# EAGLE design LDAQ-MINI (EAGLE 6.6.0)
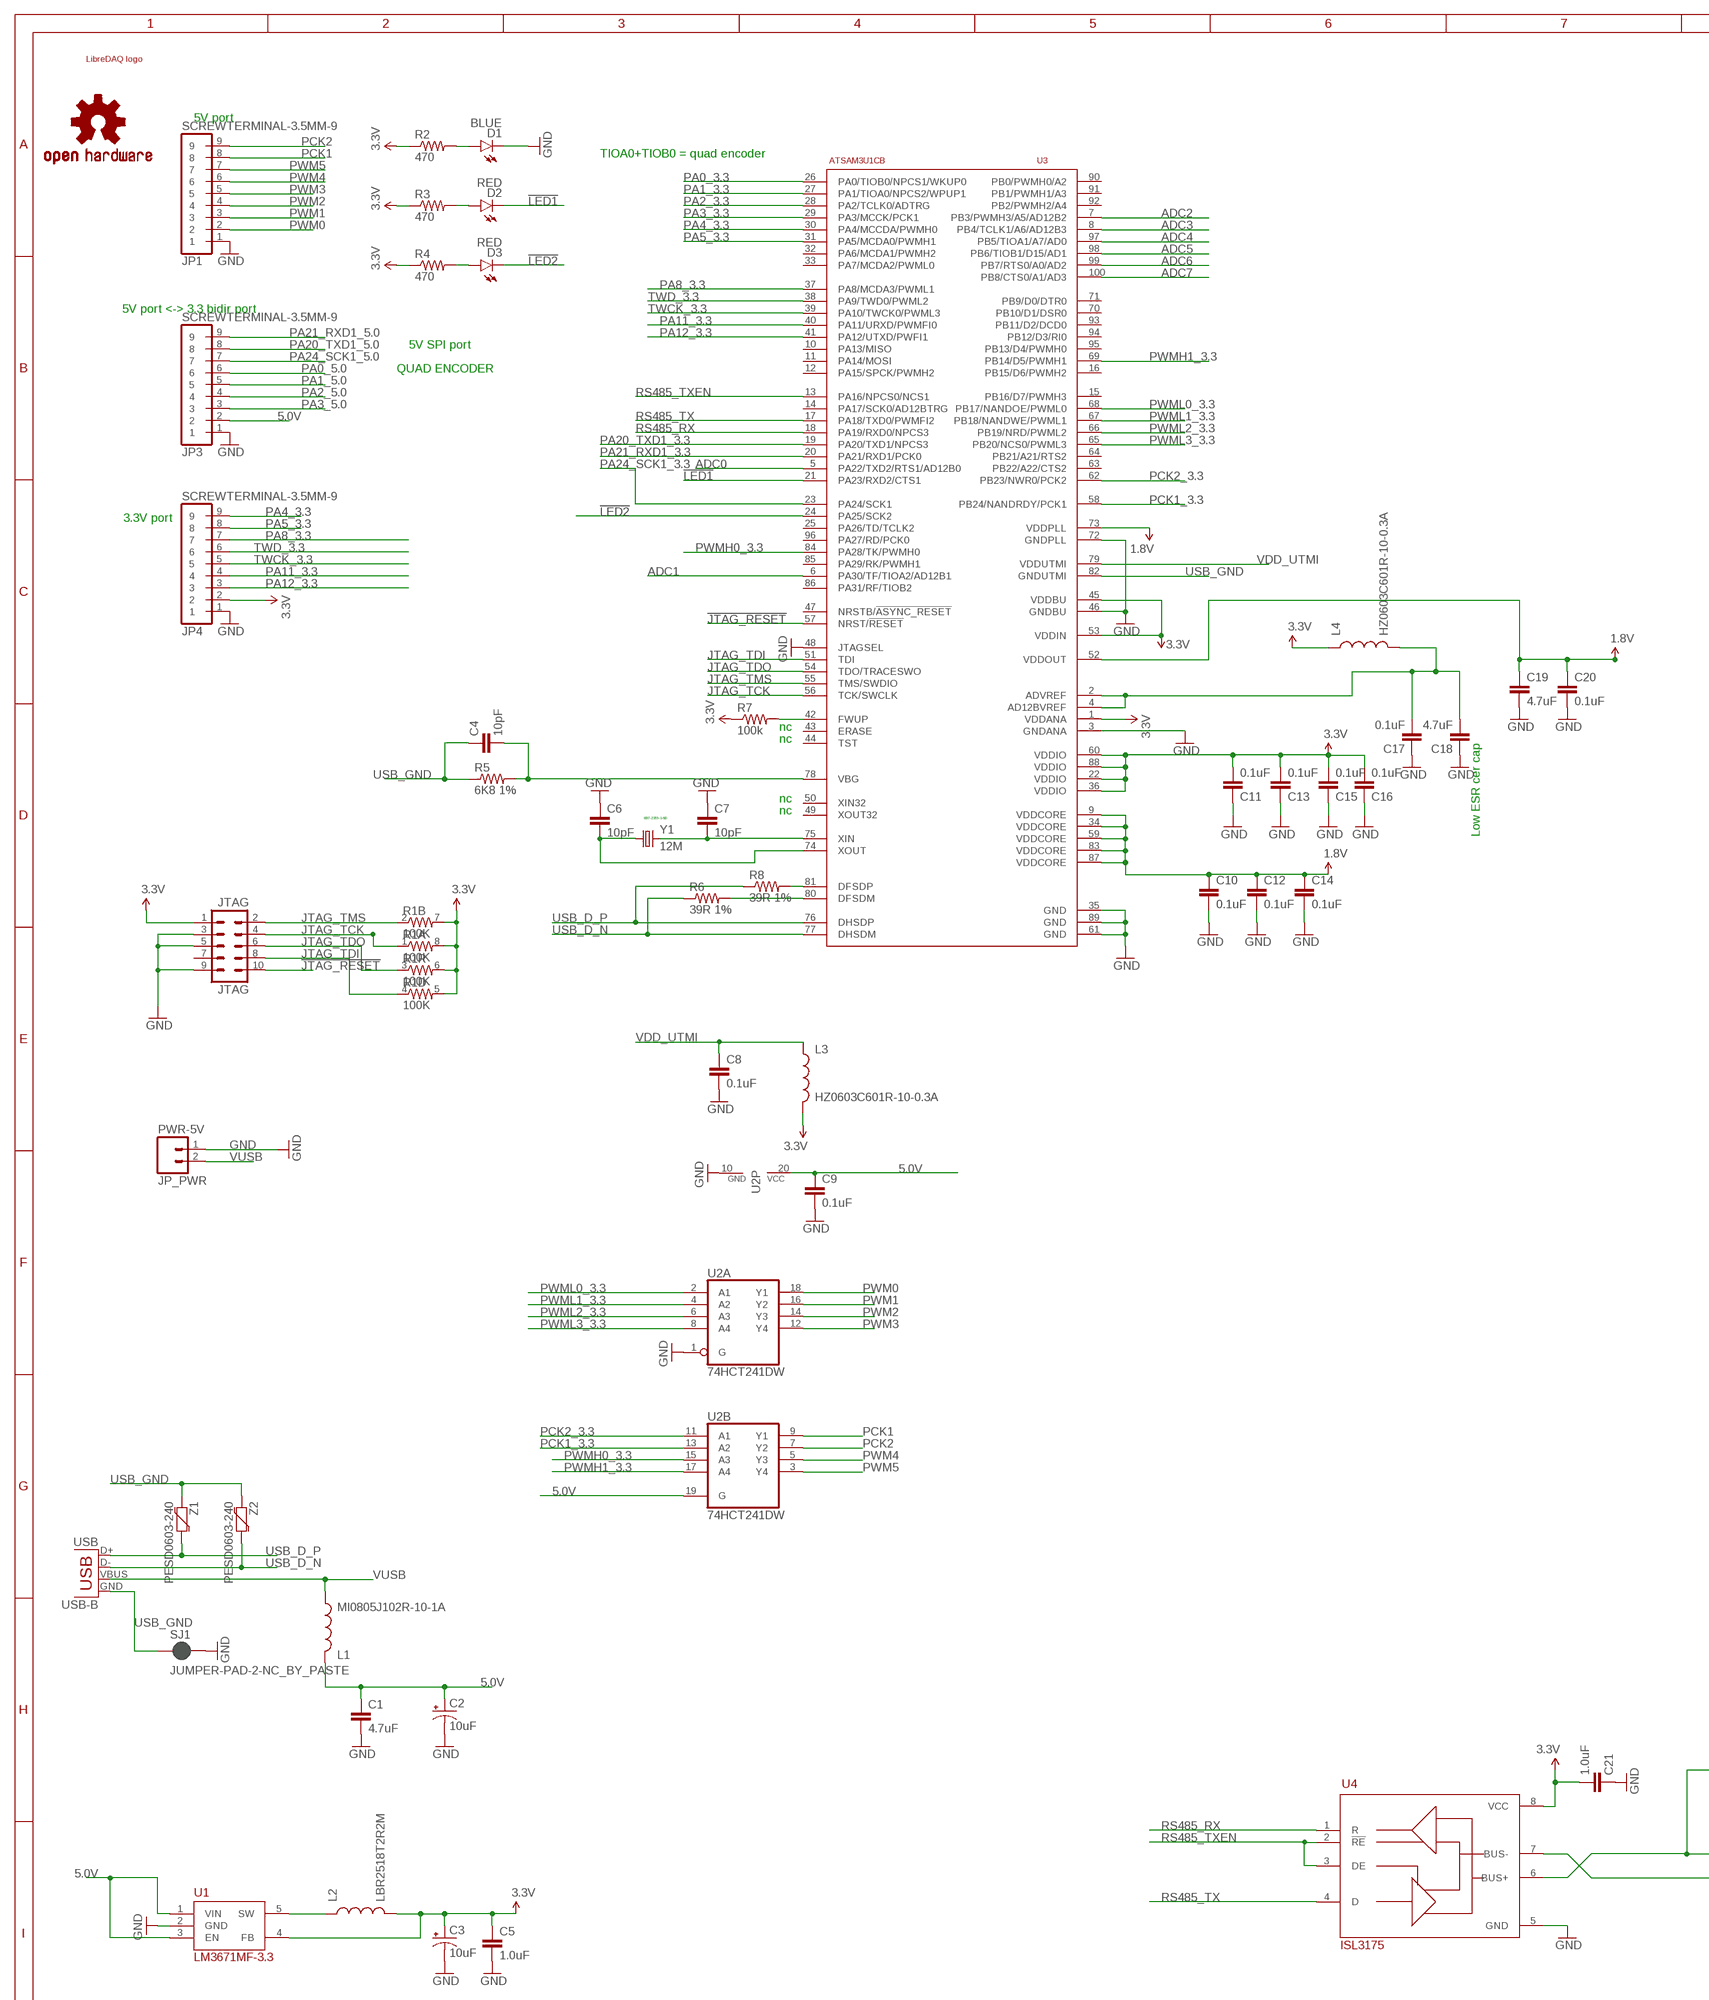
[diagram p0: schematic, sheet 1, part 1 of 2]
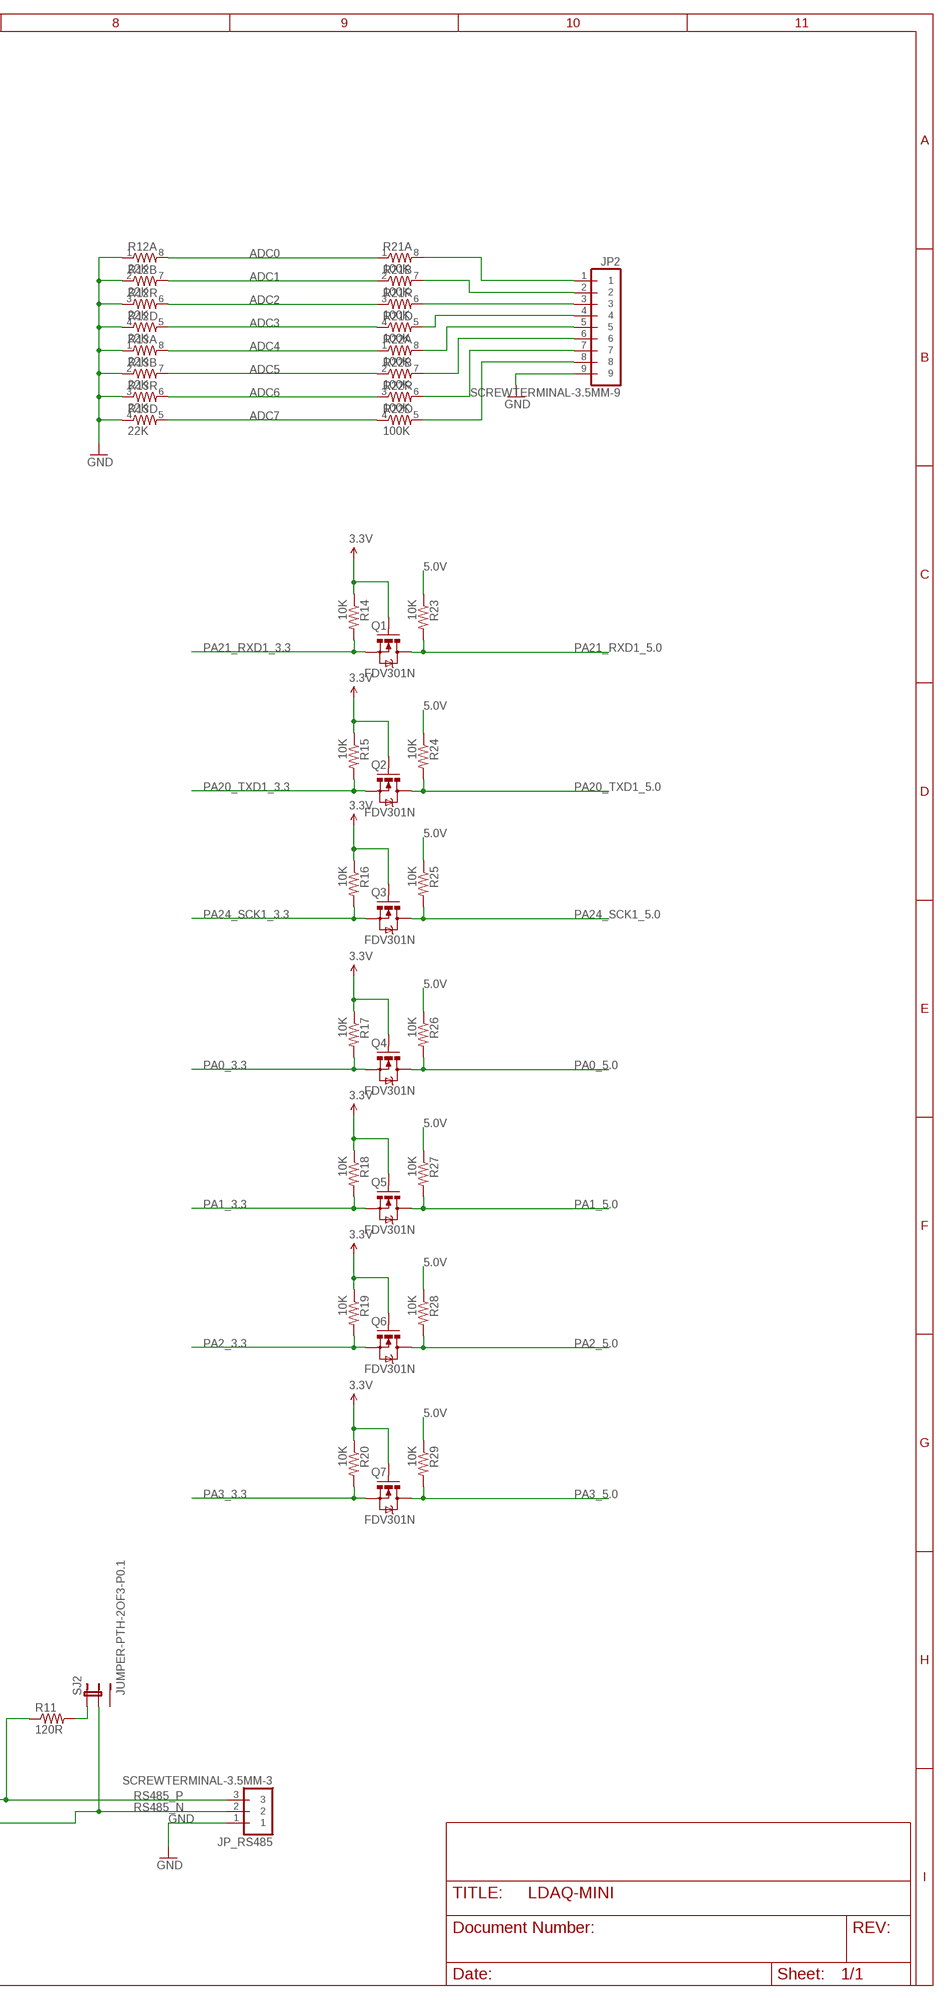
[diagram p1: schematic, sheet 1, part 2 of 2]

## Parts
C1  4.7uF  CAP0603-CAP  [0603-CAP]
C2  10uF  CAP_POL1206  [EIA3216]
C3  10uF  10UF-16V-10%(TANT)  [EIA3216]
C4  10pF  10PF-50V-5%(0603)  [0603-CAP]
C5  1.0uF  1.0UF-25V-+80/-20(0805)  [0805]
C6  10pF  22PF-50V-5%(0603)  [0603-CAP]
C7  10pF  22PF-50V-5%(0603)  [0603-CAP]
C8  0.1uF  0.1UF-25V(+80/-20%)(0603)  [0603-CAP]
C9  0.1uF  0.1UF-25V(+80/-20%)(0603)  [0603-CAP]
C10  0.1uF  0.1UF-25V(+80/-20%)(0603)  [0603-CAP]
C11  0.1uF  0.1UF-25V(+80/-20%)(0603)  [0603-CAP]
C12  0.1uF  0.1UF-25V(+80/-20%)(0603)  [0603-CAP]
C13  0.1uF  0.1UF-25V(+80/-20%)(0603)  [0603-CAP]
C14  0.1uF  0.1UF-25V(+80/-20%)(0603)  [0603-CAP]
C15  0.1uF  0.1UF-25V(+80/-20%)(0603)  [0603-CAP]
C16  0.1uF  0.1UF-25V(+80/-20%)(0603)  [0603-CAP]
C17  0.1uF  0.1UF-25V(+80/-20%)(0603)  [0603-CAP]
C18  4.7uF  10UF-6.3V-20%(0603)  [0603-CAP]
C19  4.7uF  4.7UF-6.3V-10%(0603)0603  [0603-CAP]
C20  0.1uF  0.1UF-25V(+80/-20%)(0603)  [0603-CAP]
C21  1.0uF  1.0UF-16V-10%(0603)  [0603-CAP]
D1  BLUE  LED-BLUE1206  [LED-1206]
D2  RED  LED-RED1206  [LED-1206]
D3  RED  LED-RED1206  [LED-1206]
JP1  SCREWTERMINAL-3.5MM-9  [SCREWTERMINAL-3.5MM-9]
JP2  SCREWTERMINAL-3.5MM-9  [SCREWTERMINAL-3.5MM-9]
JP3  SCREWTERMINAL-3.5MM-9  [SCREWTERMINAL-3.5MM-9]
JP4  SCREWTERMINAL-3.5MM-9  [SCREWTERMINAL-3.5MM-9]
JP_PWR  PWR-5V  M02JST-PTH-VERT  [JST-2-PTH-VERT]
JP_RS485  SCREWTERMINAL-3.5MM-3  [SCREWTERMINAL-3.5MM-3]
JTAG  JTAG  M05X2PTH  [AVR_ICSP]
L1  MI0805J102R-10-1A  INDUCTOR0805  [0805]
L2  LBR2518T2R2M  INDUCTOR1007  [1007]
L3  HZ0603C601R-10-0.3A  INDUCTOR0603  [0603]
L4  HZ0603C601R-10-0.3A  INDUCTOR0603  [0603]
LOGO1  LIBREDAQ_LOGO_MINILOGO_GENERIC  [LIBREDAQ_LOGO]
LOGO2  OSHW-LOGOL  [OSHW-LOGO-L]
Q1  FDV301N  MOSFET-NCHANNELSMD  [SOT23-3]
Q2  FDV301N  MOSFET-NCHANNELSMD  [SOT23-3]
Q3  FDV301N  MOSFET-NCHANNELSMD  [SOT23-3]
Q4  FDV301N  MOSFET-NCHANNELSMD  [SOT23-3]
Q5  FDV301N  MOSFET-NCHANNELSMD  [SOT23-3]
Q6  FDV301N  MOSFET-NCHANNELSMD  [SOT23-3]
Q7  FDV301N  MOSFET-NCHANNELSMD  [SOT23-3]
R1  100K  RESISTOR-ARRAY0603-ARV  [0603-ARV]
R2  470  470OHM1/10W1%(0603)  [0603-RES]
R3  470  470OHM1/10W1%(0603)  [0603-RES]
R4  470  470OHM1/10W1%(0603)  [0603-RES]
R5  6K8 1%  RESISTOR0603  [0603-RES]
R6  39R 1%  RESISTOR0603  [0603-RES]
R7  100k  100KOHM-1/10W-1%(0603)  [0603-RES]
R8  39R 1%  RESISTOR1206  [1206]
R11  120R  RESISTOR0603  [0603-RES]
R12  22K  RESISTOR-ARRAY0603-ARV  [0603-ARV]
R13  22K  RESISTOR-ARRAY0603-ARV  [0603-ARV]
R14  10K  RESISTOR0603-RES  [0603-RES]
R15  10K  RESISTOR0603-RES  [0603-RES]
R16  10K  RESISTOR0603-RES  [0603-RES]
R17  10K  RESISTOR0603-RES  [0603-RES]
R18  10K  RESISTOR0603-RES  [0603-RES]
R19  10K  RESISTOR0603-RES  [0603-RES]
R20  10K  RESISTOR0603-RES  [0603-RES]
R21  100K  RESISTOR-ARRAY0603-ARV  [0603-ARV]
R22  100K  RESISTOR-ARRAY0603-ARV  [0603-ARV]
R23  10K  RESISTOR0603-RES  [0603-RES]
R24  10K  RESISTOR0603-RES  [0603-RES]
R25  10K  RESISTOR0603-RES  [0603-RES]
R26  10K  RESISTOR0603-RES  [0603-RES]
R27  10K  RESISTOR0603-RES  [0603-RES]
R28  10K  RESISTOR0603-RES  [0603-RES]
R29  10K  RESISTOR0603-RES  [0603-RES]
SJ1  JUMPER-PAD-2-NC_BY_PASTE  [PAD-JUMPER-2-NC_BY_PASTE_YES_SILK]
SJ2  JUMPER-PTH-2OF3-P0.1  [1X03_LONGPADS]
U1  LM3671MF-3.3  [TOP23-5]
U2  74HCT241DW  [SO20W]
U3  ATSAM3U1CB  [TQFP100]
U4  ISL3175  [SOIC8]
USB  USB-B  USBPTH  [USB-B-PTH]
Y1  12M  CRYSTAL5X3  [CRYSTAL-SMD-5X3]
Z1  PESD0603-240  VARISTOR-0603  [0603-RES]
Z2  PESD0603-240  VARISTOR-0603  [0603-RES]

## Nets
1.8V: C10.1 C12.1 C14.1 C19.1 C20.1 U3.9(VDDCORE) U3.34(VDDCORE) U3.52(VDDOUT) U3.59(VDDCORE) U3.73(VDDPLL) U3.83(VDDCORE) U3.87(VDDCORE)
3.3V: C3.A(+) C5.1 C11.2 C13.2 C15.2 C16.2 C21.2 JP4.2 JTAG.1 L2.2 L3.2 L4.1 Q1.1(G) Q2.1(G) Q3.1(G) Q4.1(G) Q5.1(G) Q6.1(G) Q7.1(G) R1.5 R1.6 R1.7 R1.8 R2.1 R3.1 R4.1 R7.1 R14.1 R15.1 R16.1 R17.1 R18.1 R19.1 R20.1 U1.4(FB) U3.1(VDDANA) U3.22(VDDIO) U3.36(VDDIO) U3.45(VDDBU) U3.53(VDDIN) U3.60(VDDIO) U3.88(VDDIO) U4.8(VCC)
5.0V: C1.1 C2.A(+) C9.1 JP3.2 L1.1 R23.1 R24.1 R25.1 R26.1 R27.1 R28.1 R29.1 U1.1(VIN) U1.3(EN) U2.19(B:G) U2.20(P:VCC)
!JTAG_RESET: JTAG.10 U3.57(NRST/!RESET)
!LED1: D2.C U3.21(PA23/RXD2/CTS1)
!LED2: D3.C U3.24(PA25/SCK2)
ADC0: R12.8 R21.1 U3.5(PA22/TXD2/RTS1/AD12B0)
ADC1: R12.7 R21.2 U3.6(PA30/TF/TIOA2/AD12B1)
ADC2: R12.6 R21.3 U3.7(PB3/PWMH3/A5/AD12B2)
ADC3: R12.5 R21.4 U3.8(PB4/TCLK1/A6/AD12B3)
ADC4: R13.8 R22.1 U3.97(PB5/TIOA1/A7/AD0)
ADC5: R13.7 R22.2 U3.98(PB6/TIOB1/D15/AD1)
ADC6: R13.6 R22.3 U3.99(PB7/RTS0/A0/AD2)
ADC7: R13.5 R22.4 U3.100(PB8/CTS0/A1/AD3)
GND: C1.2 C2.C(-) C3.C(-) C5.2 C6.1 C7.1 C8.2 C9.2 C10.2 C11.1 C12.2 C13.1 C14.2 C15.1 C16.1 C17.1 C18.1 C19.2 C20.2 C21.1 D1.C JP1.1 JP2.9 JP3.1 JP4.1 JP_PWR.1 JP_RS485.1 JTAG.3 JTAG.5 JTAG.9 R12.1 R12.2 R12.3 R12.4 R13.1 R13.2 R13.3 R13.4 SJ1.2 U1.2(GND) U2.1(A:G) U2.10(P:GND) U3.3(GNDANA) U3.35(GND) U3.46(GNDBU) U3.48(JTAGSEL) U3.61(GND) U3.72(GNDPLL) U3.89(GND) U4.5(GND)
JTAG_TCK: JTAG.4 R1.1 U3.56(TCK/SWCLK)
JTAG_TDI: JTAG.8 R1.4 U3.51(TDI)
JTAG_TDO: JTAG.6 R1.3 U3.54(TDO/TRACESWO)
JTAG_TMS: JTAG.2 R1.2 U3.55(TMS/SWDIO)
N$1: C7.2 U3.75(XIN) Y1.3
N$2: C6.2 U3.74(XOUT) Y1.1
N$3: R8.2 U3.81(DFSDP)
N$4: R6.2 U3.80(DFSDM)
N$5: C4.2 R5.2 U3.78(VBG)
N$6: R7.2 U3.42(FWUP)
N$12: L2.1 U1.5(SW)
N$15: R11.2 SJ2.1
N$16: JP2.1 R21.8
N$17: JP2.2 R21.7
N$18: JP2.3 R21.6
N$19: JP2.4 R21.5
N$20: JP2.5 R22.8
N$25: JP2.6 R22.7
N$26: JP2.7 R22.6
N$27: JP2.8 R22.5
N$30: C17.2 C18.2 L4.2 U3.2(ADVREF) U3.4(AD12BVREF)
N$31: D2.A R3.2
N$32: D3.A R4.2
N$33: D1.A R2.2
PA0_3.3: Q4.2(S) R17.2 U3.26(PA0/TIOB0/NPCS1/WKUP0)
PA0_5.0: JP3.6 Q4.3(D) R26.2
PA1_3.3: Q5.2(S) R18.2 U3.27(PA1/TIOA0/NPCS2/WPUP1)
PA1_5.0: JP3.5 Q5.3(D) R27.2
PA2_3.3: Q6.2(S) R19.2 U3.28(PA2/TCLK0/ADTRG)
PA2_5.0: JP3.4 Q6.3(D) R28.2
PA3_3.3: Q7.2(S) R20.2 U3.29(PA3/MCCK/PCK1)
PA3_5.0: JP3.3 Q7.3(D) R29.2
PA4_3.3: JP4.9 U3.30(PA4/MCCDA/PWMH0)
PA5_3.3: JP4.8 U3.31(PA5/MCDA0/PWMH1)
PA8_3.3: JP4.7 U3.37(PA8/MCDA3/PWML1)
PA11_3.3: JP4.4 U3.40(PA11/URXD/PWMFI0)
PA12_3.3: JP4.3 U3.41(PA12/UTXD/PWFI1)
PA20_TXD1_3.3: Q2.2(S) R15.2 U3.19(PA20/TXD1/NPCS3)
PA20_TXD1_5.0: JP3.8 Q2.3(D) R24.2
PA21_RXD1_3.3: Q1.2(S) R14.2 U3.20(PA21/RXD1/PCK0)
PA21_RXD1_5.0: JP3.9 Q1.3(D) R23.2
PA24_SCK1_3.3: Q3.2(S) R16.2 U3.23(PA24/SCK1)
PA24_SCK1_5.0: JP3.7 Q3.3(D) R25.2
PCK1: JP1.8 U2.9(B:Y1)
PCK1_3.3: U2.13(B:A2) U3.58(PB24/NANDRDY/PCK1)
PCK2: JP1.9 U2.7(B:Y2)
PCK2_3.3: U2.11(B:A1) U3.62(PB23/NWR0/PCK2)
PWM0: JP1.2 U2.18(A:Y1)
PWM1: JP1.3 U2.16(A:Y2)
PWM2: JP1.4 U2.14(A:Y3)
PWM3: JP1.5 U2.12(A:Y4)
PWM4: JP1.6 U2.5(B:Y3)
PWM5: JP1.7 U2.3(B:Y4)
PWMH0_3.3: U2.15(B:A3) U3.84(PA28/TK/PWMH0)
PWMH1_3.3: U2.17(B:A4) U3.69(PB14/D5/PWMH1)
PWML0_3.3: U2.2(A:A1) U3.68(PB17/NANDOE/PWML0)
PWML1_3.3: U2.4(A:A2) U3.67(PB18/NANDWE/PWML1)
PWML2_3.3: U2.6(A:A3) U3.66(PB19/NRD/PWML2)
PWML3_3.3: U2.8(A:A4) U3.65(PB20/NCS0/PWML3)
RS485_N: JP_RS485.2 SJ2.2 U4.7(BUS-)
RS485_P: JP_RS485.3 R11.1 U4.6(BUS+)
RS485_RX: U3.18(PA19/RXD0/NPCS3) U4.1(R)
RS485_TX: U3.17(PA18/TXD0/PWMFI2) U4.4(D)
RS485_TXEN: U3.13(PA16/NPCS0/NCS1) U4.2(!RE) U4.3(DE)
TWCK_3.3: JP4.5 U3.39(PA10/TWCK0/PWML3)
TWD_3.3: JP4.6 U3.38(PA9/TWD0/PWML2)
USB_D_N: R6.1 U3.77(DHSDM) USB.D- Z2.2
USB_D_P: R8.1 U3.76(DHSDP) USB.D+ Z1.2
USB_GND: C4.1 R5.1 SJ1.1 U3.82(GNDUTMI) USB.GND Z1.1 Z2.1
VDD_UTMI: C8.1 L3.1 U3.79(VDDUTMI)
VUSB: JP_PWR.2 L1.2 USB.VBUS
Unconnected: JTAG.7 SJ2.3 U3.10(PA13/MISO) U3.11(PA14/MOSI) U3.12(PA15/SPCK/PWMH2) U3.14(PA17/SCK0/AD12BTRG) U3.15(PB16/D7/PWMH3) U3.16(PB15/D6/PWMH2) U3.25(PA26/TD/TCLK2) U3.32(PA6/MCDA1/PWMH2) U3.33(PA7/MCDA2/PWML0) U3.43(ERASE) U3.44(TST) U3.47(NRSTB/!ASYNC_RESET) U3.49(XOUT32) U3.50(XIN32) U3.63(PB22/A22/CTS2) U3.64(PB21/A21/RTS2) U3.70(PB10/D1/DSR0) U3.71(PB9/D0/DTR0) U3.85(PA29/RK/PWMH1) U3.86(PA31/RF/TIOB2) U3.90(PB0/PWMH0/A2) U3.91(PB1/PWMH1/A3) U3.92(PB2/PWMH2/A4) U3.93(PB11/D2/DCD0) U3.94(PB12/D3/RI0) U3.95(PB13/D4/PWMH0) U3.96(PA27/RD/PCK0)

## Notes on the sheet
- 5V port
- TIOA0+TIOB0 = quad encoder
- 5V port <-> 3.3 bidir port
- 5V SPI port
- QUAD ENCODER
- 3.3V port
- nc
- nc | Low ESR cer cap
- nc
- nc
- 887-2355-1-ND

## Library data of the parts
C1 = SparkFun-Passives:CAP: Capacitor Standard 0603 ceramic capacitor, and 0.1" leaded capacitor.
C2 = SparkFun-Capacitors:CAP_POL: Capacitor Polarized These are standard SMD and PTH capacitors. Normally 10uF, 47uF, and 100uF in electrolytic and tantalum varieties. Always verify the external diameter of the through hole cap, it varies with capacity, voltage, and manufacturer. The EIA devices should be standard.
C3 = SparkFun-Capacitors:10UF-16V-10%(TANT): CAP-00811 1206/EIA-3216 Tantalum capacitor; PROD_ID: CAP-00811
C4 = SparkFun-Capacitors:10PF-50V-5%(0603): CAP-11812; PROD_ID: CAP-11812
C5 = SparkFun-Capacitors:1.0UF-25V-+80/-20(0805): CAP-11625; PROD_ID: CAP-11625
C6 C7 = SparkFun-Capacitors:22PF-50V-5%(0603): CAP-07876; PROD_ID: CAP-07876; VALUE: 22pF
C8-C17 C20 = SparkFun-Capacitors:0.1UF-25V(+80/-20%)(0603): CAP-00810 Ceramic Standard decoupling cap; PROD_ID: CAP-00810
C18 = SparkFun-Capacitors:10UF-6.3V-20%(0603): CAP-11015; PROD_ID: CAP-11015; VALUE: 10uF
C19 = SparkFun-Capacitors:4.7UF-6.3V-10%(0603): CAP-08280; PROD_ID: CAP-08280
C21 = SparkFun-Capacitors:1.0UF-16V-10%(0603): CAP-00868; PROD_ID: CAP-00868
D1 = SparkFun-LED:LED-BLUE: Blue LEDs for production use Various blue LEDs stocked by SparkFun production 0603 - DIO-08575 Rebel - DIO-09553 1206 - DIO-09911; PROD_ID: DIO-09911
D2 D3 = SparkFun-LED:LED-RED: Assorted Red LEDs LilyPad 1206- DIO-09912 1206- DIO-00809 0603- DIO-00819; PROD_ID: DIO-00809
JP1-JP4 = libredaq-comps:SCREWTERMINAL-3.5MM-9
JP_PWR = libredaq-comps:M02: Standard 2-pin 0.1" header. Use with - straight break away headers ( PRT-00116) - right angle break away headers (PRT-00553) - swiss pins (PRT-00743) - machine pins (PRT-00117) - female headers (PRT-00115) Molex polarized connector foot print use with: PRT-08233 with associated crimp pins and housings. 2.54_SCREWTERM for use with PRT-10571. 3.5mm Screw Terminal footprints for PRT-08084 5mm Screw Terminal footprints for use with PRT-08432
JP_RS485 = libredaq-comps:SCREWTERMINAL-3.5MM-3
JTAG = SparkFun-Connectors:M05X2: Header 5x2 Standard 10-pin dual row 0.1" header. Commonly used with AVR-ISP. Use with Spark Fun Electronics SKU: PRT-00778
L1-L4 = SparkFun-Passives:INDUCTOR: Inductors Basic Inductor/Choke - 0603 and 1206. Footprints are not proven and vary greatly between part numbers. SRN6045- 33uH, 20% 1.4A SDR0403-560KL - 56uH, 10%, 500mA RMS/740mA peak
LOGO1 = libredaq-comps:LIBREDAQ_LOGO_MINI
LOGO2 = SparkFun-Aesthetics:OSHW-LOGO: Open Source Hardware Logo This logo indicates the piece of hardware it is found on incorporates a OSHW license and/or adheres to the definition of open source hardware found here: http://freedomdefined.org/OSHW
Q1-Q7 = SparkFun:MOSFET-NCHANNEL
R1 R12 R13 R21 R22 = SparkFun-Resistors:RESISTOR-ARRAY: Array Chip Resistor Source: RS Component / Phycomp
R2-R4 = SparkFun-Resistors:470OHM1/10W1%(0603): RES-07869; PROD_ID: RES-07869
R5 R6 R8 R11 = SparkFun-Resistors:RESISTOR: Resistor Basic schematic elements and footprints for 0603, 1206, and PTH resistors.
R7 = SparkFun-Resistors:100KOHM-1/10W-1%(0603): RES-07828; PROD_ID: RES-07828
R14-R20 R23-R29 = SparkFun:RESISTOR: Resistor Basic schematic elements and footprints for 0603, 1206, and PTH resistors.
SJ1 = SparkFun-Passives:JUMPER-PAD-2-NC_BY_PASTE
SJ2 = libredaq-comps:JUMPER-PTH-2OF3-P0.1
U1 = libredaq-comps:LM3671MF-3.3: LM3671/-Q1 2-MHz, 600-mA Step-Down DC-DC Converter
U2 = libredaq-comps:74*241: Octal BUFFER and LINE DRIVER, 3-state
U3 = libredaq-comps:ATSAM3U1CB: 100-pin SAM3U4/2/1C Atmel microcontroller (ATSAM3U{1/2/4}CB) - VDDIO: 1.62-3.6V - VDDIN: 1.8V-3.6V - VDDOUT: 1.8V - VDDUTMII: 3.0-3.6V - VDDBU: (backup I/O) 1.62-3.6V - VDDPLL: 1.62-1.95V - VDDANA: 2.0-3.6V - VDDCORE: 1.62-1.95V
U4 = libredaq-comps:ISL3175: The Intersil ISL317XE are ±15kV IEC61000 ESD Protected, 3.3V-powered, single transceivers that meet both the RS-485 and RS-422 standards for balanced communication.
USB = SparkFun-Connectors:USB: USB Connectors USB-B-PTH is fully proven SKU : PRT-00139/CONN-08278 USB-miniB is fully proven SKU : PRT-00587 USB-A-PCB is untested. USB-A-H is throughly reviewed, but untested. Spark Fun Electronics SKU : PRT-00437 USB-B-SMT is throughly reviewed, but untested. Needs silkscreen touching up. USB-A-S has not been used/tested USB-MB-H has not been used/tested USB-MICROB has been used. CONN-09505; PROD_ID: CONN-08278
Y1 = SparkFun-FreqCtrl:CRYSTAL: Various standard crystals. Proven footprints.; PROD_ID: XTAL-08218
Z1 Z2 = SparkFun-DiscreteSemi:VARISTOR: Varistor Varistor (Variable resistor) is a nonlinear resistive element of the voltage dependence that resistance changes with applied voltage. Varistor is equivalent with Zener diode of two series connection.

## Board
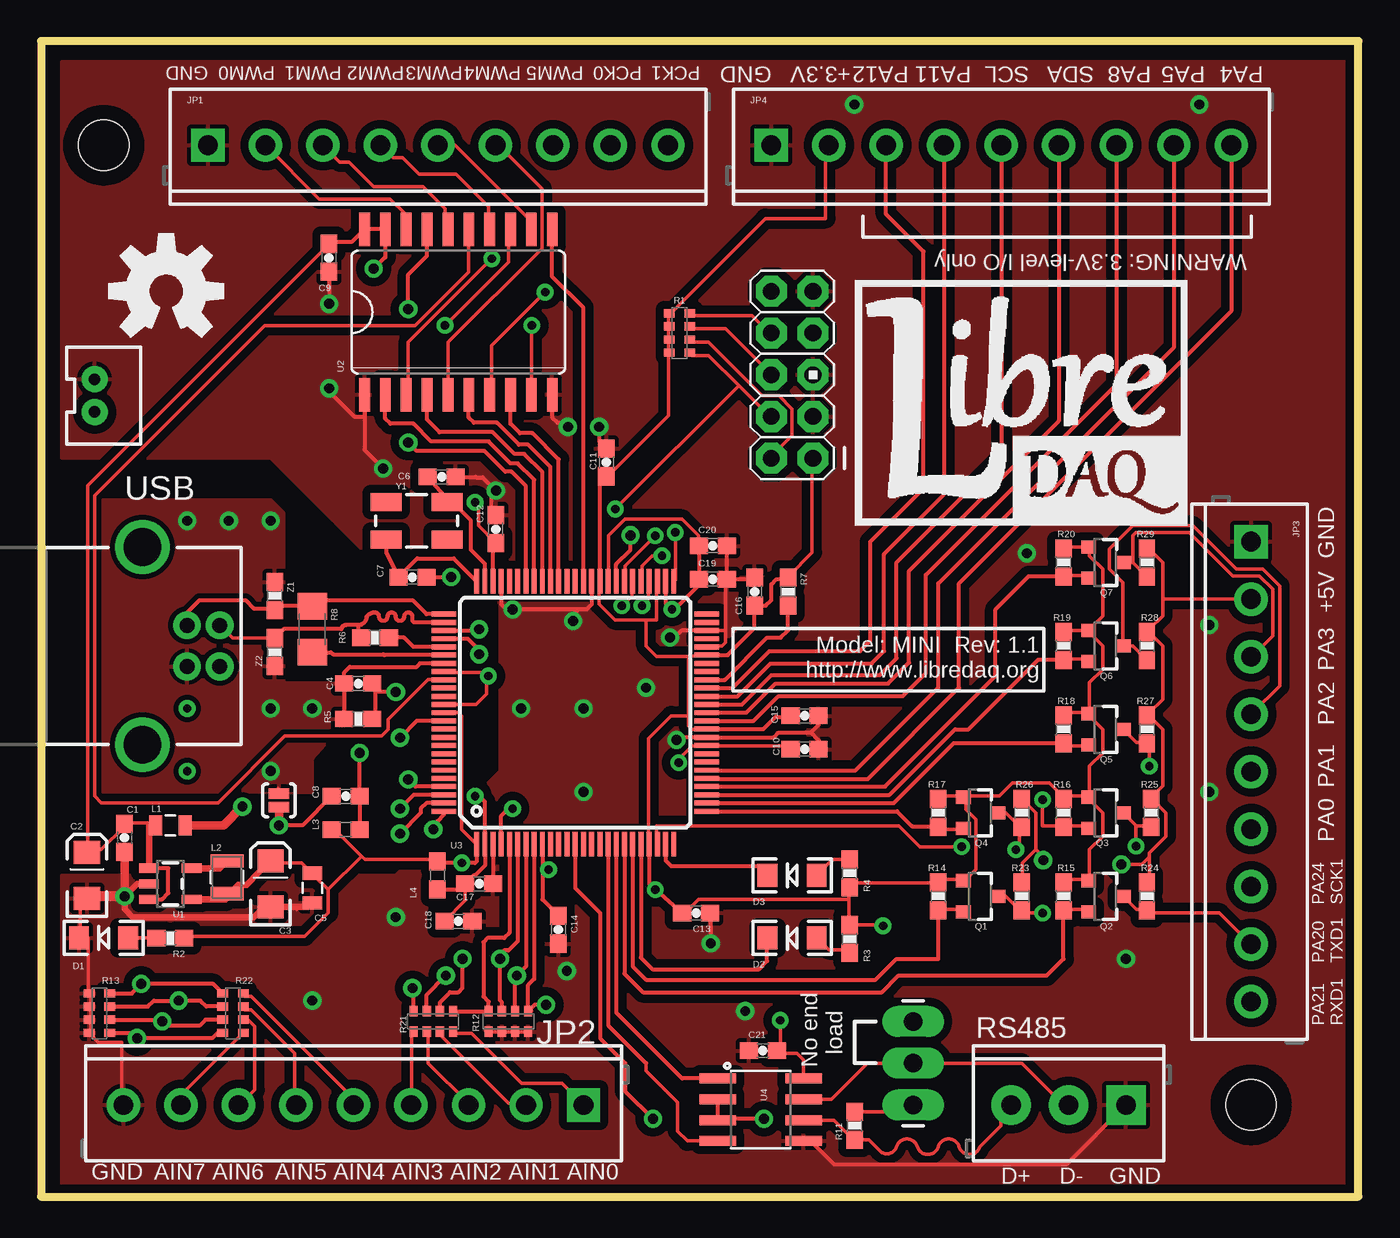
[diagram p2: board, top side]
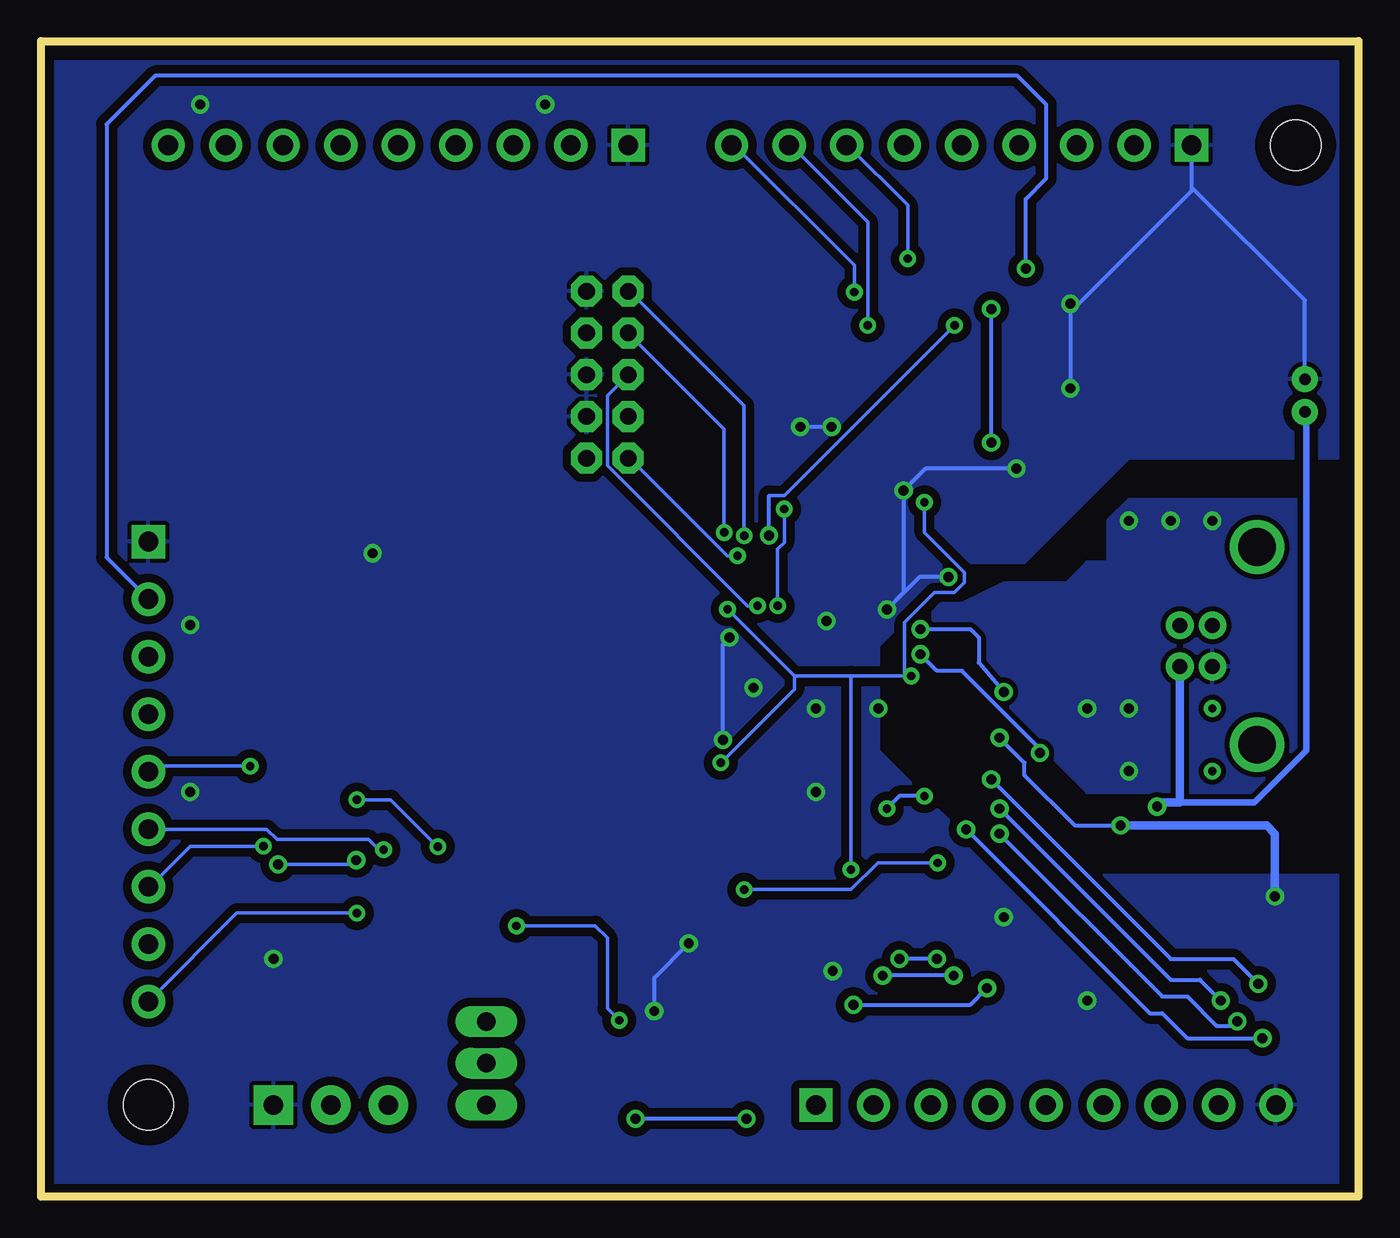
[diagram p3: board, bottom side, seen from below]

Size 80.19 x 70.35 mm. Coordinates in mm from the lower left corner, seen from the top.
Outline: 0,0 80.19,0 80.19,70.35 0,70.35 0,0
Copper layers (1*16): Top 0.035mm / dielectric 1.5mm / Bottom 0.035mm
Design rules "LibreDAQ": minimum track width 8mil, minimum drill 20mil, track to track 8mil, track to pad 7mil, pad to pad 7mil, via to via 8mil, smd to smd 7mil, copper to edge 6mil, drill to drill 8mil, minimum pad ring 12mil, minimum via ring 10mil, stop-mask expansion 4mil, vias tented up to drill 25mil, thermal gap 10mil

### Footprints (pad centres in the part's own frame; a part is rotated, then mirrored left to right if it is on the bottom)
0603-CAP = smd 1.1 x 1: 1 -0.85,0; 2 0.85,0
EIA3216 = smd 1.4 x 1.6: A 1.4,0; C -1.4,0
0805 = smd 0.8 x 1.2: 1 -0.9,0; 2 0.9,0
LED-1206 = smd 1.2 x 1.4: A -1.5,0; C 1.5,0
SCREWTERMINAL-3.5MM-9 = drill 1.2 pad 2.032 square: 1 0,0 | drill 1.2 pad 2.032: 2 3.5,0; 3 7,0; 4 10.5,0; 5 14,0; 6 17.5,0; 7 21,0; 8 24.5,0; 9 28,0
JST-2-PTH-VERT = drill 0.7 pad 1.6: 1 -1,-0.55; 2 1,-0.55
SCREWTERMINAL-3.5MM-3 = drill 1.2 pad 2.413 square: 1 0,0 | drill 1.2 pad 2.413: 2 3.5,0; 3 7,0
AVR_ICSP = drill 1.016 pad 1.88 octagon: 1 -1.27,5.08; 2 1.27,5.08; 3 -1.27,2.54; 4 1.27,2.54; 5 -1.27,0; 6 1.27,0; 7 -1.27,-2.54; 8 1.27,-2.54; 9 -1.27,-5.08; 10 1.27,-5.08
1007 = smd 2 x 0.8: 1 0,1; 2 0,-1
0603 = smd 1.1 x 1: 1 -0.85,0; 2 0.85,0
SOT23-3 = smd 0.8 x 0.9: 1 -0.95,-1; 2 0.95,-1; 3 0,1.1
0603-ARV = smd 0.5 x 0.65: 1 -1.2,-0.625; 2 -0.4,-0.625; 3 0.4,-0.625; 4 1.2,-0.625; 5 1.2,0.625; 6 0.4,0.625; 7 -0.4,0.625; 8 -1.2,0.625
0603-RES = smd 1.1 x 1: 1 -0.85,0; 2 0.85,0
1206 = smd 1.6 x 1.8: 1 -1.4,0; 2 1.4,0
PAD-JUMPER-2-NC_BY_PASTE_YES_SILK = smd 0.635 x 1.27: 1 -0.401,0; 2 0.413,0
1X03_LONGPADS = drill 1.118 pad 1.88 long: 1 0,0; 2 2.54,0; 3 5.08,0
TOP23-5 = smd 0.55 x 1.2: 1 -0.95,-1.3; 2 0,-1.3; 3 0.95,-1.3; 4 0.95,1.3; 5 -0.95,1.3
SO20W = smd 0.66 x 2.032: 1 -5.715,-5.029; 2 -4.445,-5.029; 3 -3.175,-5.029; 4 -1.905,-5.029; 5 -0.635,-5.029; 6 0.635,-5.029; 7 1.905,-5.029; 8 3.175,-5.029; 9 4.445,-5.029; 10 5.715,-5.029; 11 5.715,5.029; 12 4.445,5.029; 13 3.175,5.029; 14 1.905,5.029; 15 0.635,5.029; 16 -0.635,5.029; 17 -1.905,5.029; 18 -3.175,5.029; 19 -4.445,5.029; 20 -5.715,5.029
TQFP100 = smd 1.5 x 0.3: 1 -8,6; 2 -8,5.5; 3 -8,5; 4 -8,4.5; 5 -8,4; 6 -8,3.5; 7 -8,3; 8 -8,2.5; 9 -8,2; 10 -8,1.5; 11 -8,1; 12 -8,0.5; 13 -8,0; 14 -8,-0.5; 15 -8,-1; 16 -8,-1.5; 17 -8,-2; 18 -8,-2.5; 19 -8,-3; 20 -8,-3.5; 21 -8,-4; 22 -8,-4.5; 23 -8,-5; 24 -8,-5.5; 25 -8,-6; 51 8,-6; 52 8,-5.5; 53 8,-5; 54 8,-4.5; 55 8,-4; 56 8,-3.5; 57 8,-3; 58 8,-2.5; 59 8,-2; 60 8,-1.5; 61 8,-1; 62 8,-0.5; 63 8,0; 64 8,0.5; 65 8,1; 66 8,1.5; 67 8,2; 68 8,2.5; 69 8,3; 70 8,3.5; 71 8,4; 72 8,4.5; 73 8,5; 74 8,5.5; 75 8,6 | smd 0.3 x 1.5: 26 -6,-8; 27 -5.5,-8; 28 -5,-8; 29 -4.5,-8; 30 -4,-8; 31 -3.5,-8; 32 -3,-8; 33 -2.5,-8; 34 -2,-8; 35 -1.5,-8; 36 -1,-8; 37 -0.5,-8; 38 0,-8; 39 0.5,-8; 40 1,-8; 41 1.5,-8; 42 2,-8; 43 2.5,-8; 44 3,-8; 45 3.5,-8; 46 4,-8; 47 4.5,-8; 48 5,-8; 49 5.5,-8; 50 6,-8; 76 6,8; 77 5.5,8; 78 5,8; 79 4.5,8; 80 4,8; 81 3.5,8; 82 3,8; 83 2.5,8; 84 2,8; 85 1.5,8; 86 1,8; 87 0.5,8; 88 0,8; 89 -0.5,8; 90 -1,8; 91 -1.5,8; 92 -2,8; 93 -2.5,8; 94 -3,8; 95 -3.5,8; 96 -4,8; 97 -4.5,8; 98 -5,8; 99 -5.5,8; 100 -6,8
SOIC8 = smd 0.61 x 2.21: 1 -0.635,-2.616; 2 0.635,-2.616; 3 1.905,-2.616; 4 3.175,-2.616; 5 3.175,2.616; 6 1.905,2.616; 7 0.635,2.616; 8 -0.635,2.616
STAND-OFF-TIGHT = hole 3.048: 0,0
USB-B-PTH = drill 0.914 pad 1.676: D+ 0,1.25; D- 1.981,1.25; GND 0,-1.25; VBUS 1.981,-1.25 | drill 2.286: S1 -2.718,-6.02; S2 -2.718,6.02
CRYSTAL-SMD-5X3 = smd 1.9 x 1.1: 1 -1.85,-1.15; 2 1.85,-1.15; 3 1.85,1.15; 4 -1.85,1.15

### Placement (x,y rotation side)
C1  5.08,21.84 270 top
C2  2.79,19.56 90 top
C3  13.97,19.05 90 top
C4  19.3,31.24 0 top
C5  16.51,18.8 270 top
C6  24.38,43.81 180 top
C7  22.61,37.72 180 top
C8  18.54,24.38 180 top
C9  17.53,57.15 270 top
C10  46.48,27.24 0 top
C11  34.42,44.7 270 top
C12  27.69,40.64 90 top
C13  39.88,17.27 180 top
C14  31.5,16.26 270 top
C15  46.48,29.27 180 top
C16  43.43,36.83 270 top
C17  26.67,19.05 180 top
C18  25.4,16.76 180 top
C19  40.89,37.59 0 top
C20  40.89,39.62 0 top
C21  43.94,8.89 0 top
D1  3.81,15.75 180 top
D2  45.72,15.75 180 top
D3  45.72,19.56 180 top
JP1  10.16,64.01 0 top
JP2  33.02,5.59 180 top
JP3  73.66,39.88 270 top
JP4  44.45,64.01 0 top
JP_PWR  3.81,48.77 270 top
JP_RS485  66.04,5.59 180 top
JTAG  45.72,50.04 180 top
L1  7.87,22.61 0 top
L2  11.32,19.45 0 top
L3  18.54,22.35 180 top
L4  24.13,19.56 270 top
LOGO1  49.53,40.89 0 top
LOGO2  7.62,55.12 0 top
Q1  57.15,18.29 270 top
Q2  64.77,18.29 270 top
Q3  64.77,23.37 270 top
Q4  57.15,23.37 270 top
Q5  64.77,28.45 270 top
Q6  64.77,33.53 270 top
Q7  64.77,38.61 270 top
R1  38.86,52.58 90 top
R2  7.87,15.75 180 top
R3  49.21,15.68 270 top
R4  49.21,19.68 90 top
R5  19.3,29.08 0 top
R6  20.32,34.04 0 top
R7  45.47,36.83 270 top
R8  16.51,34.54 270 top
R11  49.53,4.32 90 top
R12  28.45,10.67 0 top
R13  3.56,11.18 270 top
R14  54.61,18.29 270 top
R15  62.23,18.29 270 top
R16  62.23,23.37 270 top
R17  54.61,23.37 270 top
R18  62.23,28.45 270 top
R19  62.23,33.53 270 top
R20  62.23,38.61 270 top
R21  23.88,10.67 180 top
R22  11.68,11.18 270 top
R23  59.69,18.29 270 top
R24  67.31,18.29 270 top
R25  67.56,23.37 270 top
R26  59.69,23.37 270 top
R27  67.31,28.45 270 top
R28  67.31,33.53 270 top
R29  67.31,38.61 270 top
SJ1  14.48,24.13 270 top
SJ2  53.09,5.59 90 top
U1  7.87,19.05 270 top
U2  25.4,53.85 0 top
U3  32.51,29.46 90 top
U4  43.8,6.57 270 top
U$2  [STAND-OFF-TIGHT]  3.81,64.01 0 top
U$4  [STAND-OFF-TIGHT]  73.66,5.59 0 top
USB  8.89,33.53 0 top
Y1  22.86,41.15 180 top
Z1  14.22,36.58 270 top
Z2  14.22,33.15 90 top

### Tracks (layer width: path | path; a pad name or v marks a point on that pad's centre or on a via)
1.8V  (via drill 0.51)
  Top 0.203: C10.1 45.52,27.43 40.64,27.43 U3.34 40.44,27.43 39.62,27.43 38.81,26.62 v38.81,26.42 | U3.83 24.59,31.9 27.03,31.9 v27.23,31.7 27.11,31.59 27.11,30.61 26.47,29.96 U3.87 | v38.41,35.76 38.41,35.88 | U3.59 34.54,37.59 34.54,40.23 35.56,41.25 39.01,41.25 40.03,40.23 C20.1 | v26.42,42.27 26.62,42.06 26.62,40.84 27.64,39.83 C12.1 | v30.89,19.91 30.51,19.91 30.48,19.91
  Top 0.254: C20.1 C19.1 40.04,37.25 38.67,35.88 38.41,35.88 38.29,35.88 38.01,36.16 U3.52 | U3.9 30.51,19.91 30.51,18.09 C14.1 | U3.73 27.51,39.62 C12.1
  Bottom 0.203: 34.34,31.7 30.89,31.7 | 30.89,31.7 27.64,31.7 | v38.41,35.76 34.34,31.7 | v26.42,42.27 26.42,40.44 23.98,38 23.98,37.39 24.59,36.78 25.81,36.78 27.64,34.95 27.64,31.7 | 27.64,31.7 v27.23,31.7 | 30.89,31.7 v30.89,19.91 | v38.81,26.42 34.34,30.89 34.34,31.7
3.3V  (via drill 0.51)
  Top 0.203: R20.1 62.23,39.56 63.66,39.56 Q7.1 63.8,39.42 63.8,39.01 64.62,38.2 64.62,35.36 63.8,34.54 Q6.1 | Q6.1 63.66,34.48 62.23,34.48 R19.1 | Q4.1 56.08,24.38 54.66,24.38 R17.1 | 49.17,18.09 49.17,18.69 R4.1 49.38,18.9 49.58,19.1 54.46,19.1 R14.1 54.66,19.3 56.08,19.3 Q1.1 56.29,19.3 56.9,19.91 56.9,22.96 56.29,23.57 56.29,24.18 Q4.1 | 49.17,18.09 49.17,16.66 R3.1 51.2,16.54 v51.25,16.49 | R15.1 62.38,19.3 63.6,19.3 Q2.1 63.8,19.3 63.8,21.13 64.62,21.95 64.62,23.37 63.8,24.18 Q3.1 | Q3.1 63.6,24.38 62.38,24.38 R16.1 62.18,24.38 61.37,25.2 59.13,25.2 58.32,24.38 56.29,24.38 Q4.1 | Q5.1 63.6,29.46 62.38,29.46 R18.1 | Q5.1 63.8,29.46 63.8,31.29 64.62,32.11 64.62,33.53 63.8,34.34 Q6.1 | Q3.1 63.8,24.38 63.8,26.21 64.62,27.03 64.62,28.45 63.8,29.26 Q5.1 | U3.88 25.4,29.46 25.6,29.26 25.6,22.35 26.42,21.54 U3.1 | 19.51,20.73 17.88,22.35 L3.2 | 19.51,20.73 19.71,20.52 23.98,20.52 L4.1 | 39.42,29.27 39.42,32.71 39.56,32.86 | 39.42,29.27 39.42,28.65 39.62,28.45 40.44,28.45 U3.36 | 39.56,32.86 39.62,32.92 40.44,32.92 U3.45 | U3.22 36.98,21.54 36.98,27.9 38.35,29.27 39.42,29.27 | JP4.2 47.75,64.01 47.75,59.54 44.09,59.54 38.41,53.85 R1.5 38.2,53.64 38.2,53.03 R1.6 38.2,52.83 38.2,52.22 R1.7 38.2,52.02 38.2,51.41 R1.8 38.2,51.21 38.2,47.55 34.54,43.89 C11.2 | 49.17,18.09 40.03,18.09 39.22,17.27 C13.2 | U3.53 37.47,37.34 37.47,35.12 36.83,35.12 | 39.56,32.86 39.53,32.89 37.47,32.89 36.83,33.53 36.83,35.12 | 36.83,35.12 34.92,35.12 33.97,36.07 33.97,37.34 U3.60 | 17.48,18.69 17.48,17.27 16.05,15.85 8.74,15.85 R2.1 | 17.48,18.69 16.66,19.51 C5.1 16.46,19.71 15.85,20.32 14.02,20.32 C3.A
  Top 0.203: 19.51,20.73 17.48,18.69 | JTAG.1 46.94,44.91 46.94,39.22 45.52,37.8 R7.1 | v37.39,18.69 v37.39,18.7 | U4.8 46.42,8.32 46,8.74 44.94,8.74 C21.2 45,9.1 v45,10.74
  Top 0.254: U3.1 26.51,20.42 26.42,20.32 v25.6,20.32 24.22,20.32 L4.1 | U3.22 37.01,19.03 v37.39,18.7 C13.2 | U3.36 43.96,28.46 44.7,29.21 45.57,29.21 C15.2 | R7.1 45.38,37.59 44.77,37.59 44.45,37.27 44.45,36.32 44.11,35.98 C16.2 43.43,34.61 41.79,32.96 U3.45 | U3.60 34.01,43.45 C11.2
  Top 0.406: C3.A 13.26,19.74 13.25,19.74 12.5,18.99 12,18.99 11.43,18.42 11.43,18.29 11.24,18.1 U1.4 10.98,18.1 L2.2
  Bottom 0.203: v25.6,20.32 29.26,20.32 30.89,18.69 v37.39,18.69 | v51.25,16.49 46.46,16.49 45.72,15.75 45.72,11.46 v45,10.74
5.0V  (via drill 0.6)
  Top 0.203: 67.63,24.16 R25.1 | 60.55,21.13 59.74,20.32 59.74,19.3 R23.1 | 60.55,21.13 60.55,23.37 59.74,24.18 R26.1 | 67.46,20.7 67.46,19.3 R24.1 | R25.1 67.67,24.18 68.48,23.37 68.48,21.95 67.46,20.93 67.46,20.7 | R25.1 67.67,24.38 68.28,24.99 68.28,28.45 67.46,29.26 R27.1 67.46,29.46 68.28,30.28 68.28,33.53 67.46,34.34 R28.1 67.46,34.54 68.28,35.36 68.28,36.37 | 68.28,36.37 68.28,38.61 67.46,39.42 R29.1 | 68.28,36.37 73.56,36.37 JP3.2 | 17.68,58.12 C9.1 17.48,57.91 2.85,43.28 2.85,21.13 | 19.51,58.73 U2.20 19.71,58.93 | 20.93,58.93 U2.19 | 6.57,22.61 6.5,22.76 5.08,22.76 C1.1 5.08,22.55 3.66,21.13 2.85,21.13 | 2.85,21.13 C2.A | 67.46,20.7 67,20.24 v65.75,20.24 | v61,20.49 61,20.69 60.55,21.13
  Top 0.254: 17.68,58.12 18.9,58.12 19.51,58.73 | 19.71,58.93 20.93,58.93 | U2.19 20.95,57.19 v20.25,56.49 | U1.3 7.36,18.1 7.75,18.49 7.75,19.99 6.59,19.99 U1.1
  Top 0.406: L1.1 6.57,22.61 U1.1
  Bottom 0.203: v65.75,20.24 61.25,20.24 v61,20.49
  Bottom 0.254: v20.25,56.49 20.25,60.74 19,61.99 19,66.49 20.75,68.24 73.24,68.24 76.2,65.28 76.2,38.92 JP3.2
!JTAG_RESET  (via drill 0.51)
  Top 0.203: v37.39,40.23 35.56,38.41 35.56,37.59 U3.57
  Bottom 0.203: v37.39,40.23 37.39,48.16 44.3,55.07 JTAG.10
!LED1
  Top 0.254: U3.21 36.51,14.54 37.21,13.84 43.69,13.84 44.2,14.35 44.2,15.72 D2.C
!LED2
  Top 0.254: U3.24 38.01,20.47 38.35,20.13 43.65,20.13 D3.C
ADC0
  Top 0.254: U3.5 28.51,16.07 28.19,15.75 27.18,15.75 26.92,15.49 26.92,12.19 27.25,11.87 R12.8 R21.1
ADC1  (via drill 0.6)
  Top 0.254: U3.6 29.01,15.55 28.45,14.99 28.19,14.99 27.94,14.73 v27.94,14.48 27.94,11.94 28.05,11.83 R12.7 | R21.2 24.28,11.83 24.89,12.45 25.4,12.45 25.65,12.7 v25.65,14.48
  Bottom 0.254: v25.65,14.48 v27.94,14.48
ADC2  (via drill 0.6)
  Top 0.254: U3.7 29.51,14.02 v28.96,13.46 28.85,13.35 R12.6 | R21.3 23.48,12.3 v24.64,13.46
  Bottom 0.254: v24.64,13.46 v28.96,13.46
ADC3  (via drill 0.6)
  Top 0.254: U3.8 30.01,13.25 29.65,12.88 R12.5 | R12.5 29.84,11.29 | R21.4 22.68,12.63 v22.61,12.7 | v30.73,11.68 30.04,11.68 R12.5
  Bottom 0.254: v30.73,11.68 23.62,11.68 v22.61,12.7
ADC4  (via drill 0.6)
  Top 0.254: U3.97 22.79,24.96 v22.35,25.4 | R13.8 5.52,12.38 v6.1,12.95 10.48,12.95 R22.1
  Bottom 0.254: v6.1,12.95 7.62,14.48 11.43,14.48 v22.35,25.4
ADC5  (via drill 0.6)
  Top 0.254: U3.98 22.69,24.46 v21.84,23.62 | R13.7 6.5,11.58 6.86,11.94 v8.38,11.94 9.69,11.94 10.05,11.58 R22.2
  Bottom 0.254: v21.84,23.62 11.43,13.21 9.65,13.21 v8.38,11.94
ADC6  (via drill 0.6)
  Top 0.254: R13.6 7.26,10.78 v7.37,10.67 7.62,10.41 9.65,10.41 10.01,10.78 R22.3 | U3.99 23.46,23.96 23.11,23.62 23.11,23.37 v21.84,22.1
  Bottom 0.254: v21.84,22.1 11.94,12.19 10.41,12.19 8.64,10.41 7.62,10.41 v7.37,10.67
ADC7  (via drill 0.6)
  Top 0.254: R13.5 5.52,9.98 v5.84,9.65 10.41,9.65 10.74,9.98 R22.4 | U3.100 24.51,23.24 24.13,22.86 24.13,22.61 v23.88,22.35
  Bottom 0.254: v23.88,22.35 12.7,11.18 11.94,11.18 10.41,9.65 v5.84,9.65
GND  (via drill 0.6, 0.6 pad 0.38, 0.6 pad 0.41)
  Top 0.203: 2.38,15.75 2.38,18.13 2.54,18.13 C2.C | 2.38,15.75 2.86,15.75 2.86,12.41 R13.1 3.02,12.26 3.02,11.62 R13.2 3.02,11.46 3.02,10.83 R13.3 3.02,10.67 3.02,10.03 R13.4 3.02,9.87 3.49,9.4 4.92,9.4 4.92,5.59 JP2.9 | 2.38,15.75 D1.C | 27.15,10.19 R12.1 27.3,10.03 27.94,10.03 R12.2 28.1,10.03 28.73,10.03 R12.3 28.89,10.03 29.53,10.03 R12.4 29.69,10.03 | 15.56,17.49 15.56,17.65 | 41.66,34.48 41.66,37.39 41.25,37.8 41.25,38 41.45,38 41.45,37.8 41.25,37.59 41.25,37.19 41.45,37.19 41.45,37.39 41.66,37.59 C19.2 | 41.66,34.48 41.66,33.73 41.45,33.53 40.64,33.53 U3.46 | C13.1 40.8,17.34 40.83,17.34 | 41.66,34.48 40.64,34.48 U3.48 | 43.18,8.92 43.34,8.92
  Top 0.254: 16.21,17.65 C5.2 | C8.2 15.91,22.61 v14.48,22.61 | U3.89 22.87,28.96 v21.84,27.94 | U3.3 C17.1 | C20.2 C19.2 43.35,37.59 C16.1 43.43,37.59 43.18,37.34 | 27.77,41.58 C12.2 27.41,41.49 27.41,42.71 v27.69,42.99 26.89,43.79 26.48,43.79 | C7.1 v24.96,37.72 | U3.72 28.01,36.08 28,36.07 28.32,35.75 v28.7,35.75 32.7,35.75 | U3.61 33.51,36.05 33.21,35.75 32.7,35.75 | 46.86,28.26 44.9,28.26 44.6,27.96 U3.35 38.82,27.96 v38.67,27.81 | C10.2 47.33,27.79 46.86,28.26 | C15.1 47.33,28.73 46.86,28.26 | U2.10 31.11,47.44 31.43,47.12 31.81,47.12 v32.07,46.86 | v32.38,35.05 32.38,35.43 32.7,35.75 | C6.1 26.45,43.81 | U2.1 19.68,47.5 | 19.68,47.5 19.68,45.47 v20.83,44.32 | C9.2 v17.53,54.36 | v17.53,49.21 17.53,49.02 19.05,47.5 19.68,47.5 | v40.77,15.43 40.77,17.23 C13.1 | v33.97,46.86 33.97,46 C11.1 | v38.29,34.04 38.54,34.04 38.97,34.46 U3.48 | 46.83,3.37 46.87,3.37 48.25,1.99 62.44,1.99 JP_RS485.1
  Top 0.406: 16.21,17.65 15.56,17.65 C3.C 13.59,17.65 12.95,17.02 5.59,17.02 5.08,17.53 v5.08,18.29 5.84,19.05 U1.2
  Top 0.508: SJ1.2 v14.48,22.61 | v5.08,18.29 C1.2
  Top 0.61: v5.08,18.29 2.92,18.29 C2.C
  Bottom 0.254: v14.48,22.61 17.27,22.61 20.32,25.65 20.32,26.42 v21.84,27.94 | v24.96,37.72 26.73,37.72 v28.7,35.75 27.69,36.77 v27.69,42.99 26.35,44.32 v20.83,44.32 | v17.53,54.36 17.53,53.85 | 17.53,53.85 v17.53,49.21 | JP1.1 10.16,61.47 | 10.16,61.47 10.16,61.21 17.53,53.85 | JP_PWR.1 3.26,54.57 10.16,61.47 | v42.86,11.3 42.86,13.33 v40.77,15.43 | v32.07,46.86 v33.97,46.86 | v38.67,27.81 38.67,33.66 v38.29,34.04
  Bottom 0.508: v14.48,22.61 5.59,22.61 5.08,22.1 v5.08,18.29
  other vias: 16.51,11.94 21.59,17.02 32,13.74 49.5,66.49 70.5,66.49 60,39.17 71.12,34.8 71.12,24.64 66.04,14.48 33.02,29.72 36.83,30.99 33.02,24.64 29.21,29.72
  pour Top (isolate 0.508): 1.27,69.09 1.27,44.96 13.97,44.96 20.32,38.61 25.4,38.61 27.94,36.07 27.94,25.91 21.59,19.56 1.27,19.56 1.27,0.51 79.5,0.51 79.5,69.09
  pour Bottom (isolate 0.508): 1.27,69.09 1.27,44.96 13.97,44.96 20.32,38.61 25.4,38.61 25.4,37.34 29.21,33.53 29.21,27.18 21.59,19.56 1.27,19.56 1.27,0.51 79.5,0.51 79.5,69.09
JTAG_TCK  (via drill 0.51)
  Top 0.203: 42.47,49.38 44.3,47.55 JTAG.4 | 42.47,49.38 40.64,51.21 39.62,51.21 R1.1 | v35.36,35.97 35.97,36.58 35.97,37.39 U3.56 | 42.47,49.38 v34.95,41.86
  Bottom 0.203: v35.36,35.97 35.36,39.42 34.95,39.83 v34.95,41.86
JTAG_TDI  (via drill 0.51)
  Top 0.203: R1.4 39.62,53.64 43.28,53.64 44.3,52.63 JTAG.8 | v38.61,40.44 38.61,37.59 U3.51
  Bottom 0.203: v38.61,40.44 38.61,46.74 JTAG.8
JTAG_TDO  (via drill 0.51)
  Top 0.203: JTAG.6 41.66,52.83 39.62,52.83 R1.3 | v36.58,35.97 36.98,36.37 36.98,37.39 U3.54
  Bottom 0.203: v36.58,35.97 37.19,35.97 45.72,44.5 45.72,48.77 JTAG.6
JTAG_TMS  (via drill 0.51)
  Top 0.203: R1.2 39.62,52.02 40.64,52.02 43.89,48.77 44.91,48.77 45.72,47.95 45.72,46.33 44.5,45.11 JTAG.2 | v37.8,39.01 37.19,39.01 36.58,38.41 36.58,37.59 U3.55
  Bottom 0.203: v37.8,39.01 38.41,39.01 44.3,44.91 JTAG.2
N$1
  Top 0.254: Y1.3 21.01,39.23 C7.2 22.9,38.86 25.11,38.86 U3.75
N$2
  Top 0.254: U3.74 27.01,38.52 26.16,39.37 26.16,41.15 25.4,41.91 25.1,41.91 Y1.1 | Y1.1 25.03,42.3 | C6.2 24.8,42.39 Y1.1
N$3
  Top 0.254: R8.2 17.66,33.14 17.78,33.02 20.83,33.02 20.88,32.96 U3.81
N$4
  Top 0.254: U3.80 22.67,33.46 22.1,34.04 R6.2
N$5  (via drill 0.6 pad 0.38)
  Top 0.254: U3.78 26.59,34.46 v26.67,34.54 | C4.2 20.66,30.73 v21.59,30.73 20.57,30.73 20.32,30.99 20.32,29.5 R5.2
  Bottom 0.254: v26.67,34.54 23.62,34.54 23.11,34.04 23.11,32.51 v21.59,30.73
N$6
  Top 0.254: U3.42 41.62,31.46 44.2,34.04 45.02,34.04 45.47,34.48 R7.2
N$12
  Top 0.406: U1.5 10.88,20 L2.1
N$15
  Top 0.203: R11.2 52.67,5.17 SJ2.1
N$16
  Top 0.203: JP2.1 31.7,6.91 29.26,6.91 26.21,9.96 25.2,9.96 R21.8
N$17
  Top 0.203: R21.7 24.38,9.96 24.38,9.75 28.45,5.69 29.46,5.69 JP2.2
N$18
  Top 0.203: R21.6 23.57,9.96 23.57,8.13 26.01,5.69 JP2.3
N$19
  Top 0.203: 22.54,10.03 R21.5 22.55,9.96 22.55,5.69 JP2.4 22.54,5.59
N$20
  Top 0.203: R22.8 12.39,12.19 12.8,12.19 18.9,6.1 18.9,5.69 JP2.5
N$25
  Top 0.203: R22.7 12.39,11.38 12.8,11.38 15.44,8.74 15.44,5.69 JP2.6
N$26
  Top 0.203: R22.6 12.39,10.77 12.6,10.77 13.01,10.36 13.01,6.5 12.19,5.69 JP2.7
N$27
  Top 0.203: R22.5 12.22,9.87 8.57,6.22 8.57,5.59 JP2.8
N$30  (via drill 0.51)
  Top 0.203: C17.2 25.82,18.03 C18.2
  Top 0.254: 25.73,18.71 C17.2 | C17.2 26.33,19.56 26.42,19.56 27.01,20.15 U3.2 27.01,24.04 26.67,24.38 v26.42,24.38 | L4.2 25.48,18.71 C17.2 | v28.7,23.62 28.45,23.62 28.01,23.19 U3.4
  Bottom 0.254: v26.42,24.38 27.94,24.38 v28.7,23.62
N$31
  Top 0.203: R3.2 49.17,15.04 47.95,15.04 47.35,15.65 D2.A
N$32
  Top 0.203: R4.2 49.17,20.52 48.16,20.52 47.35,19.71 D3.A
N$33
  Top 0.203: D1.A R2.2
N$34  (via drill 0.51)
  other vias: 8.89,25.91
N$35  (via drill 0.51)
  other vias: 8.89,29.72
PA0_3.3
  Top 0.203: Q4.2 56.08,22.35 54.66,22.35 R17.2
  Top 0.254: U3.26 52.1,23.46 53.02,22.54 54.59,22.54 R17.2
PA0_5.0  (via drill 0.51)
  Top 0.203: Q4.3 58.73,23.37 59.54,22.55 R26.2 59.54,22.35 59.54,21.34 v59.33,21.13
  Bottom 0.203: JP3.6 73.56,22.35 66.45,22.35 65.83,21.74 60.25,21.74 59.65,21.13 v59.33,21.13
PA1_3.3
  Top 0.203: Q5.2 63.6,27.43 62.38,27.43 R18.2
  Top 0.254: U3.27 51.9,23.96 55.54,27.6 R18.2
PA1_5.0  (via drill 0.51)
  Top 0.203: Q5.3 65.88,28.45 66.67,27.65 67.31,27.65 R27.2 67.46,27.43 v67.46,26.21
  Bottom 0.203: v67.46,26.21 73.36,26.21 73.56,26.01 JP3.5
PA2_3.3
  Top 0.203: Q6.2 63.66,32.73 62.23,32.73 R19.2
  Top 0.254: U3.28 51.64,24.46 55.63,28.45 56.45,28.45 60.68,32.68 R19.2
PA2_5.0
  Top 0.203: R28.2 67.26,32.71 66.45,33.53 Q6.3 65.84,33.53 65.84,37.39 65.02,38.2 65.02,39.42 66.45,40.84 70.1,40.84 72.75,38.2 74.37,38.2 75.39,37.19 75.39,31.09 73.76,29.46 JP3.4
PA3_3.3
  Top 0.203: Q7.2 63.66,37.81 62.23,37.81 R20.2
  Top 0.254: U3.29 51.38,24.96 58.1,31.69 58.1,35.75 60.11,37.76 R20.2
PA3_5.0
  Top 0.203: 66.45,38.61 Q7.3 | 66.45,38.61 67.26,37.8 R29.2 | 66.45,38.61 66.45,40.23 66.65,40.44 69.9,40.44 72.54,37.8 74.17,37.8 74.98,36.98 74.98,34.14 73.76,32.92 JP3.3
PA4_3.3
  Top 0.203: 40.64,25.43 U3.30
  Top 0.254: 40.64,25.43 50.32,25.43 55.88,30.99 55.88,37.34 72.45,53.91 JP4.9
PA5_3.3
  Top 0.254: U3.31 49.59,25.96 54.61,30.99 54.61,37.34 68.95,51.68 JP4.8
PA8_3.3
  Top 0.254: U3.37 43.38,28.96 44.9,30.48 52.45,30.48 53.85,31.88 53.85,37.85 65.45,49.45 JP4.7
PA11_3.3
  Top 0.254: U3.40 42.4,30.46 44.39,32.45 50.55,32.45 51.31,33.21 51.31,39.12 54.95,42.76 JP4.4
PA12_3.3
  Top 0.254: U3.41 42.08,30.96 44.32,33.21 49.85,33.21 50.48,33.85 50.48,39.88 53.72,43.12 53.72,57.53 51.44,59.82 51.44,63.99 JP4.3
PA20_TXD1_3.3
  Top 0.203: Q2.2 63.66,17.49 62.23,17.49 R15.2
  Top 0.254: U3.19 35.51,13.57 36.64,12.45 51.18,12.45 52.2,13.46 61.21,13.46 62.23,14.48 R15.2
PA20_TXD1_5.0
  Top 0.203: Q2.3 65.88,18.29 66.67,17.49 67.31,17.49 R24.2 67.46,17.27 71.73,17.27 73.56,15.44 JP3.8
PA21_RXD1_3.3
  Top 0.203: Q1.2 56.04,17.49 54.61,17.49 R14.2
  Top 0.254: U3.20 36.01,14.03 36.83,13.21 50.8,13.21 52.07,14.48 54.61,14.48 R14.2
PA21_RXD1_5.0  (via drill 0.51)
  Top 0.203: Q1.3 58.73,18.29 59.54,17.47 R23.2 59.74,17.27 v60.96,17.27
  Bottom 0.203: v60.96,17.27 68.28,17.27 73.56,11.99 JP3.9
PA24_SCK1_3.3  (via drill 0.51)
  Top 0.203: 62.23,22.57 63.66,22.57 Q3.2 | v56.04,21.3 53.5,21.3 52.23,22.57 37.47,22.57 37.47,21.62 U3.23 | v60.96,24.16 60.96,22.57 62.23,22.57 | 62.23,22.57 R16.2
  Top 0.254: 62.23,22.1 R16.2
  Bottom 0.203: v56.04,21.3 58.9,24.16 v60.96,24.16
PA24_SCK1_5.0  (via drill 0.51)
  Top 0.203: 66.67,22.57 65.88,23.37 Q3.3 | 66.67,22.57 67.47,22.57 R25.2 | v66.65,21.34 66.65,22.55 66.67,22.57
  Bottom 0.203: v66.65,21.34 71.12,21.34 73.56,18.9 JP3.7
PCK1  (via drill 0.51)
  Top 0.203: v29.87,53.03 29.87,48.97 U2.9
  Bottom 0.203: v29.87,53.03 29.87,59.33 34.54,64.01 JP1.8
PCK1_3.3  (via drill 0.51, 0.6)
  Top 0.203: v24.59,53.03 28.45,56.9 28.45,58.73 U2.13
  Top 0.254: U3.58 35.01,38.51 35.88,39.37 v35.88,40.26
  Bottom 0.203: v24.59,53.03 34.95,42.67 35.88,42.67
  Bottom 0.254: v35.88,40.26 35.88,42.67
PCK2  (via drill 0.51)
  Top 0.203: v30.68,55.07 27.43,51.82 27.43,48.97 U2.7
  Bottom 0.203: v30.68,55.07 30.68,56.69 38,64.01 JP1.9
PCK2_3.3
  Top 0.254: U3.62 33.01,54.11 31.11,56.01 U2.11
PWM0
  Top 0.203: U2.18 22.15,58.93 22.15,59.84 21.25,60.74 16.93,60.74 JP1.2 13.82,64.01
PWM1
  Top 0.203: U2.16 24.59,58.93 24.59,60.15 23.25,61.49 20.25,61.49 18.75,62.99 18.18,62.99 JP1.3 17.27,64.01
PWM2
  Top 0.203: U2.14 27.23,58.93 27.23,60.26 25.25,62.24 23,62.24 22,63.24 21.43,63.24 JP1.4 20.73,64.01
PWM3
  Top 0.203: JP1.5 25.2,64.01 29.67,59.54 29.67,58.93 U2.12
PWM4
  Top 0.203: U2.5 24.79,48.97 24.79,52.02 30.48,57.71 30.48,61.37 27.84,64.01 JP1.6
PWM5  (via drill 0.51)
  Top 0.203: v27.43,57.1 22.35,52.02 22.35,48.97 U2.3
  Bottom 0.203: v27.43,57.1 27.43,60.35 31.09,64.01 JP1.7
PWMH0_3.3
  Top 0.203: U3.84 24.38,31.5 23.57,31.5 21.13,29.06 21.13,28.45 20.73,28.04 14.83,28.04 10.77,23.98 3.66,23.98 3.25,24.38 3.25,42.67 13.61,53.03 22.76,53.03 26.01,56.29 26.01,58.73 U2.15
PWMH1_3.3  (via drill 0.6)
  Top 0.254: U3.69 29.51,43.26 28.64,44.13 28.26,44.13 26.99,45.4 22.86,45.4 v22.35,45.91 | v22.35,54.04 22.35,56.13 23.5,57.28 U2.17
  Bottom 0.254: v22.35,45.91 v22.35,54.04
PWML0_3.3
  Top 0.254: U3.68 30.01,43.65 29.02,44.64 28.57,44.64 27.24,45.97 23.75,45.97 22.67,47.05 21.27,47.05 20.95,47.37 U2.2
PWML1_3.3
  Top 0.254: U3.67 30.51,44.1 29.4,45.21 28.83,45.21 27.5,46.55 24.26,46.55 23.5,47.31 U2.4
PWML2_3.3
  Top 0.254: U3.66 31.01,44.43 29.65,45.78 29.08,45.78 27.75,47.12 26.35,47.12 26.04,47.44 U2.6
PWML3_3.3
  Top 0.254: U3.65 31.51,44.88 29.91,46.48 29.15,46.48 28.57,47.05 U2.8
RS485_N
  Top 0.203: JP_RS485.2 62.23,5.59 59.69,8.13 SJ2.2 50.29,8.13 48.1,5.93 U4.7
RS485_P
  Top 0.203: JP_RS485.3 58.42,4.97 58.42,4.32 57.15,3.05 arc-146 55.88,3.05 arc146 54.61,3.05 arc-146 53.34,3.05 arc146 52.07,3.05 arc-118 51.05,2.79 50.38,3.47 R11.1 49.46,3.47 48.26,4.66 U4.6
RS485_RX
  Top 0.254: U3.18 35.01,11.22 39.02,7.2 U4.1
RS485_TX
  Top 0.203: 36.83,8.13 36.83,7.66 38.75,5.74 38.75,3.99 39.34,3.39 U4.4
  Top 0.254: U3.17 34.51,10.45 36.83,8.13
RS485_TXEN  (via drill 0.6)
  Top 0.254: U3.13 32.51,18.8 34.04,17.27 34.04,9.65 35.56,8.13 35.56,6.43 v37.25,4.74 | U4.2 U4.3 41.26,4.74 v44,4.74
  Bottom 0.254: v37.25,4.74 v44,4.74
TWCK_3.3
  Top 0.254: U3.39 42.66,29.96 44.45,31.75 51.05,31.75 52.07,32.77 52.07,38.61 58.45,44.99 JP4.5
TWD_3.3
  Top 0.254: U3.38 42.93,29.46 44.7,31.24 51.56,31.24 52.83,32.51 52.83,38.1 61.95,47.22 JP4.6
USB_D_N
  Top 0.203: Z2.2 11.65,34 USB.D-
  Top 0.254: Z2.2 14.77,34.54 18.29,34.54 arc-90 18.54,34.8 19.3,34.8 | U3.77 22.69,34.96 22.61,35.05 22.61,35.31 arc90 22.35,35.56 arc90 22.1,35.31 arc-180 21.59,35.31 arc90 21.34,35.56 arc90 21.08,35.31 arc-180 20.57,35.31 arc90 20.32,35.56 arc53 19.81,35.31 arc-90 19.3,34.8 | 19.3,34.8 19.3,34.2 arc90 R6.1
USB_D_P
  Top 0.254: 16.63,36.07 R8.1 | R8.1 14.44,35.94 Z1.2 14.14,35.81 12.95,35.81 12.45,36.32 9.65,36.32 8.89,35.56 USB.D+ | U3.76 23.46,35.46 22.61,36.32 16.89,36.32 R8.1
USB_GND  (via drill 0.6, 0.6 pad 0.38)
  Top 0.203: SJ1.1 14.45,24.64 14.45,24.8 14.45,24.86
  Top 0.254: U3.82 23.07,32.46 22.86,32.26 18.8,32.26 18.45,31.92 C4.1 R5.1
  other vias: 13.97,29.72 13.97,25.91 16.51,29.72 8.89,41.15 11.43,41.15 13.97,41.15
  pour Top (isolate 0.305): 3.81,24.64 3.81,42.42 13.97,42.42 14.73,41.66 14.73,25.15 14.22,24.64
  pour Bottom (isolate 0.305): 3.81,24.64 3.81,42.42 13.97,42.42 15.24,41.15 15.24,38.61 16.51,38.61 17.78,37.34 21.59,37.34 24.13,36.07 25.4,36.07 25.91,35.56 25.91,31.75 25.4,31.24 23.11,31.24 16.51,24.64
  pour Top (isolate 0.305): 13.97,24.64 16.51,24.64 16.51,26.67 18.29,28.7 18.29,31.24 14.73,31.24 14.73,25.4
VDD_UTMI  (via drill 0.6, 0.6 pad 0.41)
  Top 0.254: L3.1 C8.1 v19.39,27.01 | v26.67,33.02 26.67,33.27 25.98,33.96 U3.79
  Bottom 0.254: v19.39,27.01 19.56,27.18 19.56,27.43 24.13,32 25.65,32 v26.67,33.02
VUSB  (via drill 0.6 pad 0.38)
  Top 0.508: L1.2 11.11,22.61 v12.26,23.75
  Bottom 0.203: 3.17,47.5 JP_PWR.2
  Bottom 0.406: 3.17,47.5 3.17,27.18 6.35,24 10.87,24
  Bottom 0.508: USB.VBUS 10.87,24 12,24 v12.26,23.75

### Text on the board
tPlace: Model: MINI Rev: 1.1 / http://www.libredaq.org
tNames: GND | PWM0 | PWM1 | PWM2 | PWM3 | PWM4 | PWM5 | PCK0 | PCK1 | GND | +3.3V | PA12 | PA11 | SCL | SDA | PA8 | PA5 | PA4 | WARNING: 3.3V-level I/O only | GND | +5V | PA3 | PA2 | PA1 | PA0 | PA24 / SCK1 | PA20 / TXD1 | PA21 / RXD1 | RS485 | No end / load | GND | AIN7 | AIN6 | AIN5 | AIN4 | AIN3 | AIN2 | AIN1 | AIN0 | D+ | D- | GND